# EAGLE design Adafruit Slider Trinkey (EAGLE 9.6.2)
AUTHOR: ladyada
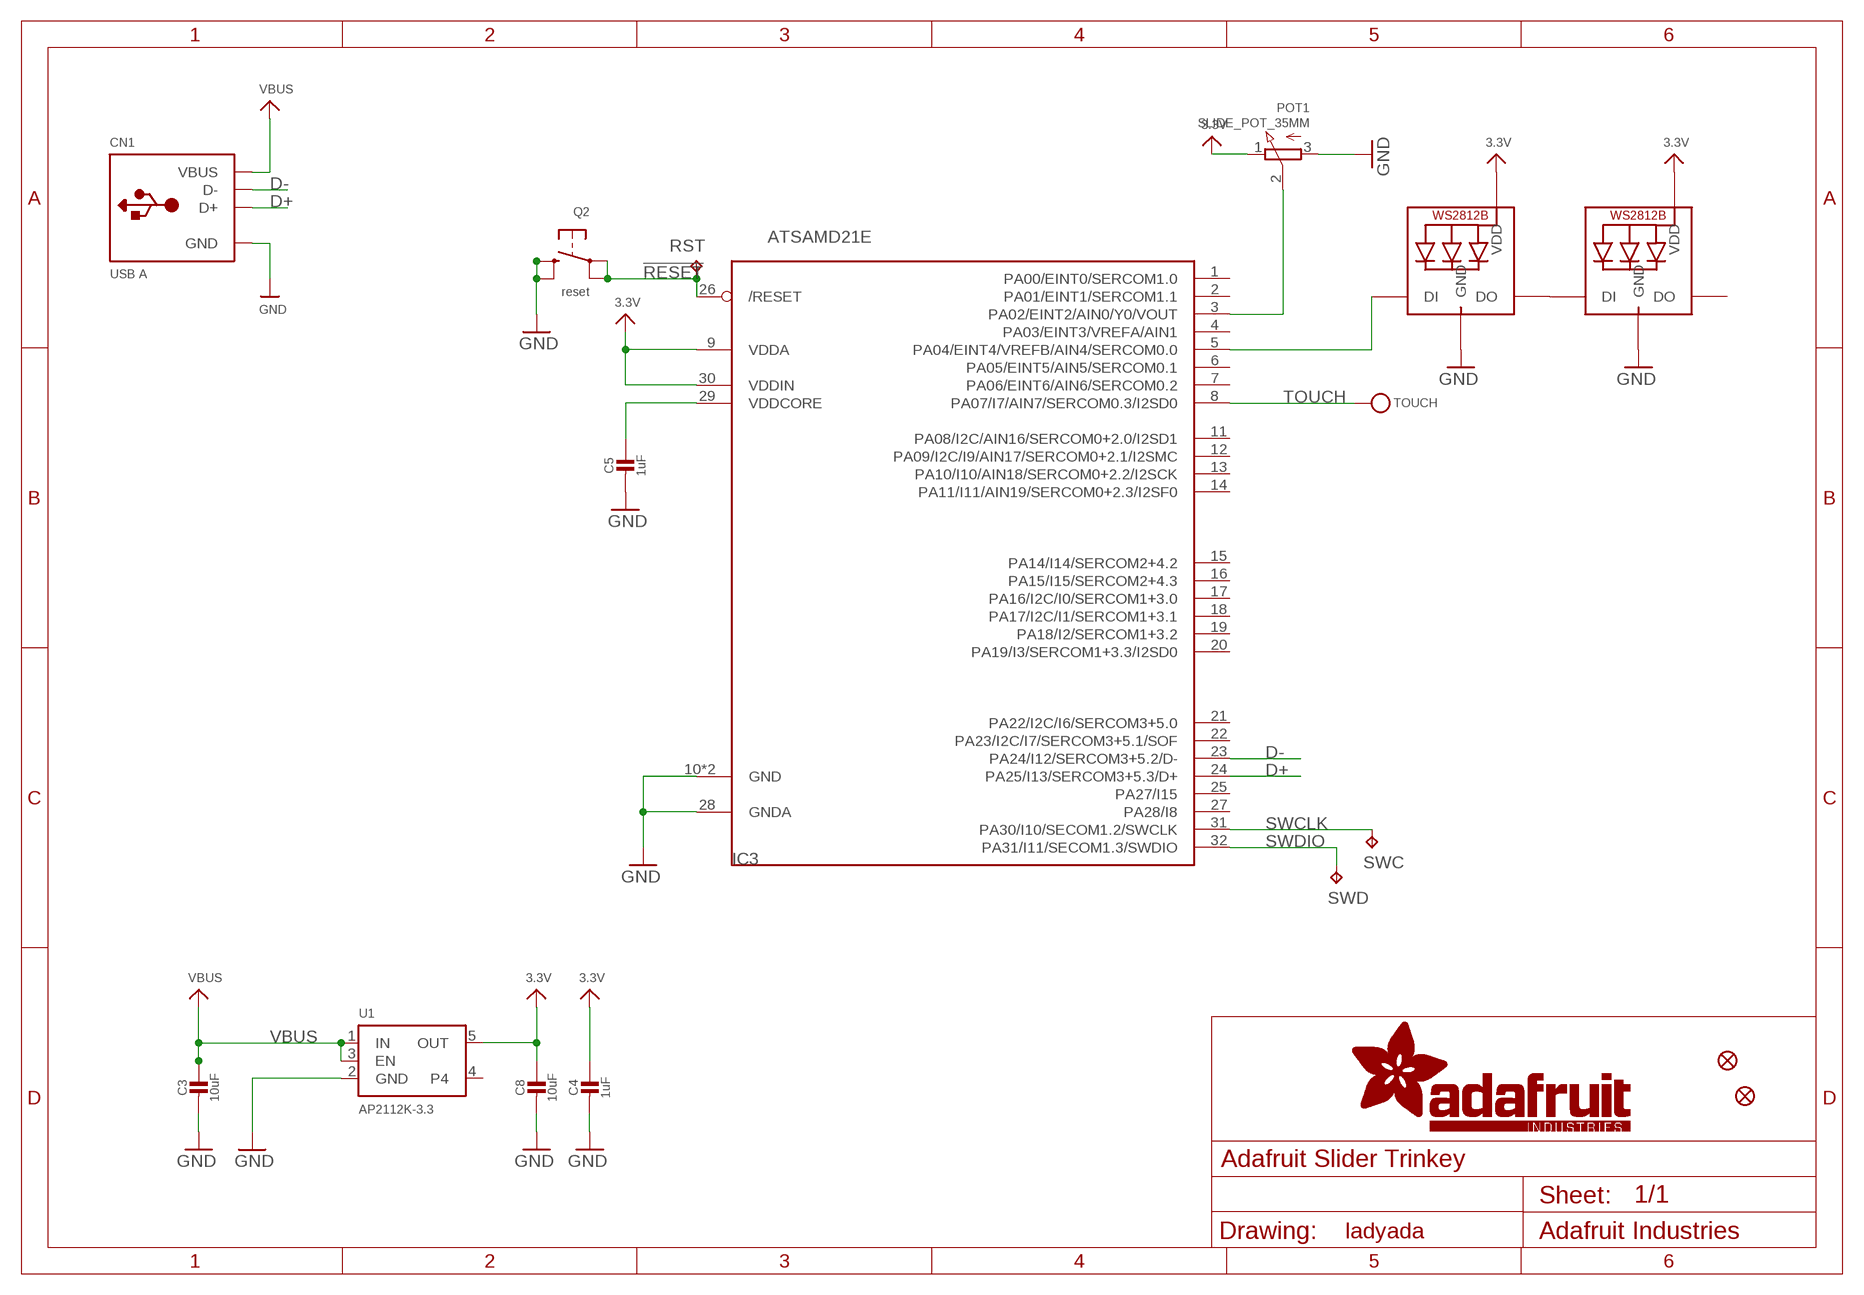
[diagram p0: schematic, sheet 1]

## Parts
C3  10uF  CAP_CERAMIC0805-NOOUTLINE  [0805-NO]
C4  1uF  CAP_CERAMIC0603_NO  [0603-NO]
C5  1uF  CAP_CERAMIC0603_NO  [0603-NO]
C8  10uF  CAP_CERAMIC0805-NOOUTLINE  [0805-NO]
CN1  USB A  USB_TYPEAPCB  [USBA_PCB]
FID1  FIDUCIAL_1MM  [FIDUCIAL_1MM]
FID2  FIDUCIAL_1MM  [FIDUCIAL_1MM]
IC3  ATSAMD21E  [QFN32_5MM]
LED1  WS2812B_SK6812E  [NEO3535_REVERSE]
LED2  WS2812B_SK6812E  [NEO3535_REVERSE]
POT1  SLIDE_POT_35MM  [SLIDE_POT_35MM]
Q2  reset  SWITCH_TACT_SMT4.6X2.8  [BTN_KMR2_4.6X2.8]
RST  TPTP16R  [TP16R]
SWC  TPTP15R  [TP15R]
SWD  TPTP16R  [TP16R]
TOUCH  TESTPOINTROUND0.5MM  [TESTPOINT_ROUND_0.5MM]
U1  AP2112K-3.3  VREG_SOT23-5  [SOT23-5]

## Nets
3.3V: C4.1 C8.1 IC3.9(VDDA) IC3.30(VDDIN) LED1.1-VDD(VDD) LED2.1-VDD(VDD) POT1.1(E) U1.5(OUT)
!RESET: IC3.26(/RESET) Q2.A'(P1) Q2.A(P) RST.TP
D+: CN1.USB_PLUS(D+) IC3.24(PA25/I13/SERCOM3+5.3/D+)
D-: CN1.USB_NEG(D-) IC3.23(PA24/I12/SERCOM3+5.2/D-)
GND: C3.2 C4.2 C5.2 C8.2 CN1.GND IC3.10(GND) IC3.28(GNDA) IC3.33(GND) LED1.3-GND(GND) LED2.3-GND(GND) POT1.3(A) Q2.B'(S1) Q2.B(S) U1.2(GND)
N$1: IC3.5(PA04/EINT4/VREFB/AIN4/SERCOM0.0) LED1.4-DIN(DI)
N$2: LED1.2-DOUT(DO) LED2.4-DIN(DI)
POT: IC3.3(PA02/EINT2/AIN0/Y0/VOUT) POT1.2(S)
SWCLK: IC3.31(PA30/I10/SECOM1.2/SWCLK) SWC.TP
SWDIO: IC3.32(PA31/I11/SECOM1.3/SWDIO) SWD.TP
TOUCH: IC3.8(PA07/I7/AIN7/SERCOM0.3/I2SD0) TOUCH.P$1
VBUS: C3.1 CN1.VCC(VBUS) U1.1(IN) U1.3(EN)
VDDCORE1: C5.1 IC3.29(VDDCORE)
Unconnected: IC3.1(PA00/EINT0/SERCOM1.0) IC3.2(PA01/EINT1/SERCOM1.1) IC3.4(PA03/EINT3/VREFA/AIN1) IC3.6(PA05/EINT5/AIN5/SERCOM0.1) IC3.7(PA06/EINT6/AIN6/SERCOM0.2) IC3.11(PA08/I2C/AIN16/SERCOM0+2.0/I2SD1) IC3.12(PA09/I2C/I9/AIN17/SERCOM0+2.1/I2SMC) IC3.13(PA10/I10/AIN18/SERCOM0+2.2/I2SCK) IC3.14(PA11/I11/AIN19/SERCOM0+2.3/I2SF0) IC3.15(PA14/I14/SERCOM2+4.2) IC3.16(PA15/I15/SERCOM2+4.3) IC3.17(PA16/I2C/I0/SERCOM1+3.0) IC3.18(PA17/I2C/I1/SERCOM1+3.1) IC3.19(PA18/I2/SERCOM1+3.2) IC3.20(PA19/I3/SERCOM1+3.3/I2SD0) IC3.21(PA22/I2C/I6/SERCOM3+5.0) IC3.22(PA23/I2C/I7/SERCOM3+5.1/SOF) IC3.25(PA27/I15) IC3.27(PA28/I8) LED2.2-DOUT(DO) U1.4

## Library data of the parts
C3-C5 C8 = microbuilder:CAP_CERAMIC: Ceramic Capacitors For new designs, use the packages preceded by an '_' character since they are more reliable: The following footprints should be used on most boards: _0402 - Standard footprint for regular board layouts _0603 - Standard footprint for regular board layouts _0805 - Standard footprint for regular board layouts _1206 - Standard footprint for regular board layouts For extremely tight-pitch boards where space is at a premium, the following 'micro-pitch' footprints can be used (smaller pads, no silkscreen outline, etc.): _0402MP - Micro-pitch footprint for very dense/compact boards _0603MP - Micro-pitch footprint for very dense/compact boards _0805MP - Micro-pitch footprint for very dense/compact boards _1206MP - Micro-pitch footprint for very dense/compact boards
CN1 = adafruit_electromech:USB_TYPEA: USB - Type A Connectors Male types stick out and are inserted into a PC or matching females parts (these are the connectors used on USB Memory Sticks, etc.). Female parts are generally used for USB Host and accept a male-type connector. SMT - 4UCON: 10017 PTHFML - Digikey: 609-1045-ND, 4UCon: 05241 PCB - Use 2.0mm thick PCBs with this footprint
FID1 FID2 = microbuilder:FIDUCIAL: Fiducial Alignment Points Various fiducial points for machine vision alignment.; BOM: EXCLUDE
IC3 = adafruit_micro:ATSAMD21E
LED1 LED2 = microbuilder:WS2812B
POT1 = adafruit_electromech:SLIDE_POT
Q2 = adafruit_electromech:SWITCH_TACT_SMT: SMT Tact Switches 6x6mm - Digikey: P12940SCT-ND KMR2 (4.6x2.8mm) - Digikey: 401-1426-1-ND EVQ-PQHB55 - Light Touch, 160GF (4.5x4.5mm) - Digikey: P8090SCT-ND KMT0 - KMT021 NGJ LHS (etc.) IP68/Waterproof - Digikey: CKN10289CT-ND
RST SWC SWD = testpad:TP: Test pad
TOUCH = microbuilder:TESTPOINT: Test Point Various test points for characterisation and PCB testing TESTPOINT_SMT - Compact Surface Mount Test Point [Digikey: 5016KTR-ND]
U1 = adafruit_power:VREG_SOT23-5: SOT23-5 Fixed Voltage Regulators Part Current Out V Out V In V Dropout θJA (°C/W) TJ (°C) Digikey Part No. ADP121 150mA 3.3V 3.4-5.5V 0.09V @ 150mA -- -- ADP121-AUJZ33R7CT-ND ADP121 150mA 3.0V 3.1-5.5V 0.09V @ 150mA -- -- ADP121-AUJZ30R7CT-ND ADP122 300mA 3.3V 3.4-5.5V 0.085V @ 300mA -- -- ADP122AUJZ-3.3-R7CT-ND ADP1712 300mA 3.3V 3.5-5.5V 0.17V @ 300mA -- -- ADP1712AUJZ-3.3-R7TR-ND AP7311 (Low Cost) 150mA 3.3V 3.5-6V 0.15V @ 150mA -- -- AP7311-33WG-7DICT-ND LD39015M18R 150mA 1.8V 1.9V-5.5V 0.08V @ 100mA -- -- 497-6977-1-ND LP2985A-33DBVR 150mA 3.3V 3.3-16V 0.28V @ 150mA 206 150 296-18479-1-ND MCP1824T-3302E/OT 300mA 3.3V 3.5V-6V 0.2V @ 300mA -- -- MCP1824T-3302E/OTCT-ND MIC5205-2.5YM5 TR 150mA 2.5V 2.7-16V 0.165V @ 150mA -- -- 576-1257-2-ND MIC5205-3.0YM5 TR 150mA 3.0V 3.2V-16V 0.165V @ 150mA -- -- 576-1258-2-ND MIC5205-3.3YM5 TR 150mA 3.3V 3.5V-16V 0.165V @ 150mA -- -- 576-1259-2-ND TPS780330220 150mA 3.3V+2.2V 3.6-5.5V 250mV Max -- -- 296-23332-1-ND TDA3663/N1,135 100mA 3.3V 3.5-45V 0.18V @ 50mA -- -- 568-5343-1-ND Max operating temp can be calculated using θJA, TJ (max junction temperature), and power in watts. Set the "Maximum Ambient Temperature" until it reaches TJ ("Max Junction Temperature"), which is the absolute limit for safe use of the regulator: Heat Sink Temperature Calculator <http://www.daycounter.com/Calculators/Heat-Sink-Temperature-Calculator.phtml> For example, With 12V source into a 3.3V LP2985 and a 30mA load, we are dissipating (12V-3.3V) * 0.03A = 0.261W. With a θJA of 206 °C/W, a TJ of 150°C, and 261mW we can safely use the chip without a heat sink up to 75°C (=147.1°C Junction Temperature).

## Board
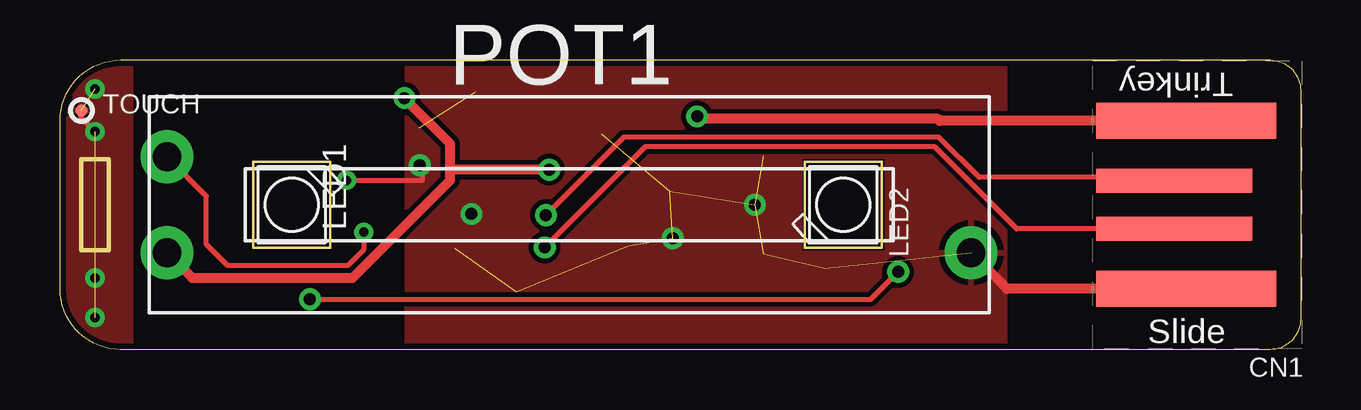
[diagram p1: board, top side]
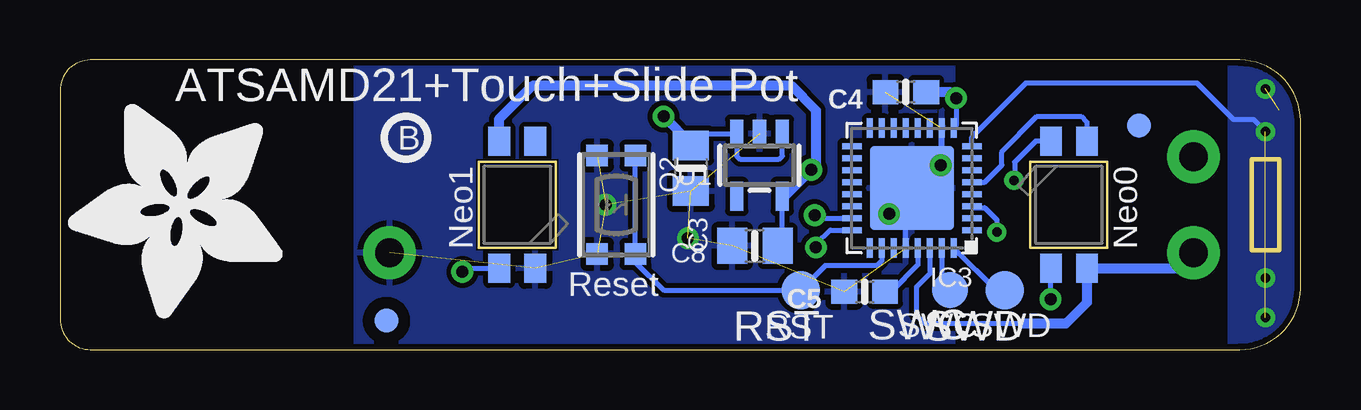
[diagram p2: board, bottom side, seen from below]

Size 51.69 x 12.06 mm. Coordinates in mm from the lower left corner, seen from the top.
Outline: 51.69,1.27 arc-90 50.42,0 2.54,0 arc-90 0,2.54 0,9.53 arc-90 2.54,12.06 50.42,12.06 arc-90 51.69,10.8 51.69,1.27
Copper layers (1*16): Top 0.035mm / dielectric 1.5mm / Bottom 0.035mm
Design rules "adafruit 8-8 *": minimum track width 8mil, minimum drill 15.5mil, track to track 8mil, track to pad 8mil, pad to pad 8mil, via to via 8mil, smd to smd 8mil, copper to edge 10mil, drill to drill 8mil, minimum pad ring 10mil, minimum via ring 8mil, stop-mask expansion 2mil, vias tented up to drill 20mil, thermal gap 10mil
Milling: 4 lines

### Footprints (pad centres in the part's own frame; a part is rotated, then mirrored left to right if it is on the bottom)
0805-NO = smd 1.24 x 1.5: 1 -0.95,0; 2 0.95,0
0603-NO = smd 1.075 x 1: 1 -0.85,0; 2 0.85,0
USBA_PCB = smd 7.5 x 1.5: GND -0.2,3.5; VCC -0.2,-3.5 | smd 6.5 x 1: USB_NEG 0.3,-1; USB_PLUS 0.3,1
FIDUCIAL_1MM = smd 1 x 1: 1 0,0
QFN32_5MM = smd 0.8 x 0.25: 1 -2.5,1.75; 2 -2.5,1.25; 3 -2.5,0.75; 4 -2.5,0.25; 5 -2.5,-0.25; 6 -2.5,-0.75; 7 -2.5,-1.25; 8 -2.5,-1.75; 17 2.5,-1.75; 18 2.5,-1.25; 19 2.5,-0.75; 20 2.5,-0.25; 21 2.5,0.25; 22 2.5,0.75; 23 2.5,1.25; 24 2.5,1.75 | smd 0.25 x 0.8: 9 -1.75,-2.5; 10 -1.25,-2.5; 11 -0.75,-2.5; 12 -0.25,-2.5; 13 0.25,-2.5; 14 0.75,-2.5; 15 1.25,-2.5; 16 1.75,-2.5; 25 1.75,2.5; 26 1.25,2.5; 27 0.75,2.5; 28 0.25,2.5; 29 -0.25,2.5; 30 -0.75,2.5; 31 -1.25,2.5; 32 -1.75,2.5 | smd 3.5 x 3.5: 33 0,0
NEO3535_REVERSE = smd 1.2 x 0.9 bottom: 1-VDD 2.65,-0.75; 2-DOUT 2.65,0.75; 3-GND -2.65,0.75; 4-DIN -2.65,-0.75
SLIDE_POT_35MM = drill 1.2 pad 2.2: 1 -16.75,-2; 2 -16.75,2; 3 16.75,-2
BTN_KMR2_4.6X2.8 = smd 0.9 x 0.9: A 2.05,0.8; A' -2.05,0.8; B 2.05,-0.8; B' -2.05,-0.8
TP16R = smd 1.6 x 1.6: TP 0,0
TP15R = smd 1.5 x 1.5: TP 0,0
TESTPOINT_ROUND_0.5MM = smd 0.5 x 0.5: P$1 0,0
SOT23-5 = smd 0.55 x 1.2: 1 -0.95,-1.3; 2 0,-1.3; 3 0.95,-1.3; 4 0.95,1.3; 5 -0.95,1.3

### Placement (x,y rotation side)
C3  25.4,7.56 270 bottom
C4  16.45,10.73 180 bottom
C5  18.16,2.41 180 bottom
C8  22.73,4.32 180 bottom
CN1  46.74,6.03 180 top
FID1  6.73,9.33 180 bottom
FID2  38.09,1.21 180 bottom
IC3  16.19,6.73 180 bottom
LED1  9.65,6.03 270 top
LED2  32.64,6.03 90 top
POT1  21.21,6.03 0 top
Q2  28.51,6.03 270 bottom
RST  20.83,2.48 180 bottom
SWC  14.61,2.48 180 bottom
SWD  12.32,2.48 180 bottom
TOUCH  0.89,9.97 0 top
U1  22.54,7.68 180 bottom
U$6  [ADAFRUIT_9MM]  42.42,10.22 180 bottom
U$8  [PCBFEAT-REV-040]  37.27,8.83 0 bottom

### Tracks (layer width: path | path; a pad name or v marks a point on that pad's centre or on a via)
3.3V  (via drill 0.5)
  Top 0.406: 16.26,7.49 16.26,8.57 v14.35,10.48 | v20.38,7.49 16.26,7.49 | POT1.1 5.51,2.98 12.19,2.98 16.26,7.05 16.26,7.49
  Bottom 0.203: C8.1 21.59,4.51 U1.5 | IC3.30 15.44,3.16 16,2.6 16,1.46 15.62,1.08 11.56,1.08 | v14.35,10.48 14.35,9.32 IC3.9
  Bottom 0.406: v14.35,10.48 14.61,10.73 C4.1 | U1.5 21.49,6.38 v20.38,7.49 20.19,7.68 20.19,9.97 21.21,10.99 32,10.99 33.4,9.59 33.4,8.69 LED2.1-VDD | POT1.1 5.11,3.38 LED1.1-VDD 8.9,1.96 9.78,1.08 11.56,1.08
!RESET
  Bottom 0.203: IC3.26 17.44,3.7 17.65,3.49 19.81,3.49 RST.TP 26.54,2.48 27.71,3.64 Q2.A Q2.A'
D+  (via drill 0.5)
  Top 0.203: CN1.USB_PLUS 39.86,5.03 36.45,8.45 24.38,8.45 v20.19,4.25
  Bottom 0.203: v20.19,4.25 20.19,4.38 19.59,4.98 IC3.24
D-  (via drill 0.5)
  Top 0.203: CN1.USB_NEG 46.29,7.18 38.29,7.18 36.62,8.85 23.5,8.85 v20.25,5.6
  Bottom 0.203: v20.25,5.6 20.13,5.48 IC3.23
GND  (via drill 0.39, 0.5)  (11 unrouted)
  Top 0.203: v11.94,7.05 15.11,7.05 15.11,7.56 v14.99,7.68
  Top 0.406: CN1.GND 39.46,2.53 POT1.3
  Bottom 0.203: IC3.28 16.44,5.45 16.19,5.7 16.19,6.67 | 15.24,7.68 14.94,7.98 IC3.10 14.99,9.19 v14.99,7.68 | LED1.3-GND 11.04,8.68 11.91,7.81 11.91,7.05 v11.94,7.05
  Bottom 0.406: 15.24,7.68 IC3.33 | IC3.33 16.19,6.67 | IC3.33 17.14,5.78 v17.14,5.65
  other vias: 28.96,6.03 25.53,4.64
  pour Bottom: 39.37,-0.06 14.48,-0.06 14.48,12.13 39.37,12.13
  pour Top: 39.37,-0.06 14.48,-0.06 14.48,12.13 39.37,12.13
N$1
  Bottom 0.203: LED1.4-DIN 8.9,9.47 9.14,9.72 10.98,9.72 12.45,8.25 12.45,7.68 13.15,6.98 IC3.5
N$2  (via drill 0.5)
  Top 0.203: v10.41,2.1 33.78,2.1 v34.92,3.24
  Bottom 0.203: v34.92,3.24 34.78,3.38 34.05,3.38 LED2.4-DIN | v10.41,2.1 10.4,2.11 LED1.2-DOUT
POT  (via drill 0.39)
  Top 0.203: v12.66,4.89 12.66,4.17 11.98,3.49 6.99,3.49 6.1,4.38 6.1,6.4 POT1.2
  Bottom 0.203: IC3.3 13.62,5.91 13.17,5.91 12.66,5.4 v12.66,4.89
SWCLK
  Bottom 0.203: IC3.31 14.94,2.81 SWC.TP
SWDIO
  Bottom 0.203: IC3.32 12.69,2.48 SWD.TP
TOUCH  (via drill 0.39)  (3 unrouted)
  Top 0.203: v1.46,9.08 0.89,9.65 TOUCH.P$1
  Bottom 0.203: 1.84,9.46 v1.46,9.08 1.97,9.59 2.79,9.59 4.32,11.11 11.43,11.11 13.69,8.85 IC3.8
  other vias: 1.46,2.98 1.46,1.33 1.46,10.86
  pour Top: 2.92,0 -0.06,0 -0.06,12 2.92,12
  pour Bottom: 2.92,0 -0.06,0 -0.06,12 2.92,12
VBUS  (via drill 0.5)
  Top 0.406: CN1.VCC 36.66,9.53 36.57,9.61 26.64,9.61 v26.54,9.72
  Bottom 0.203: C3.1 24.92,8.98 U1.3 23.49,8.06 23.37,7.94 21.72,7.94 21.59,8.06 U1.1
  Bottom 0.406: C3.1 25.4,8.57 v26.54,9.72
VDDCORE1
  Bottom 0.203: IC3.29 15.94,3.53 17.06,2.41 C5.1

### Text on the board
tPlace: Trinkey | Slide
bPlace: ATSAMD21+Touch+Slide Pot | Neo0 | Neo1 | Reset | SWD | SWC | RST
tValues: C1898